# EAGLE design Mixer (EAGLE 9.3.1)
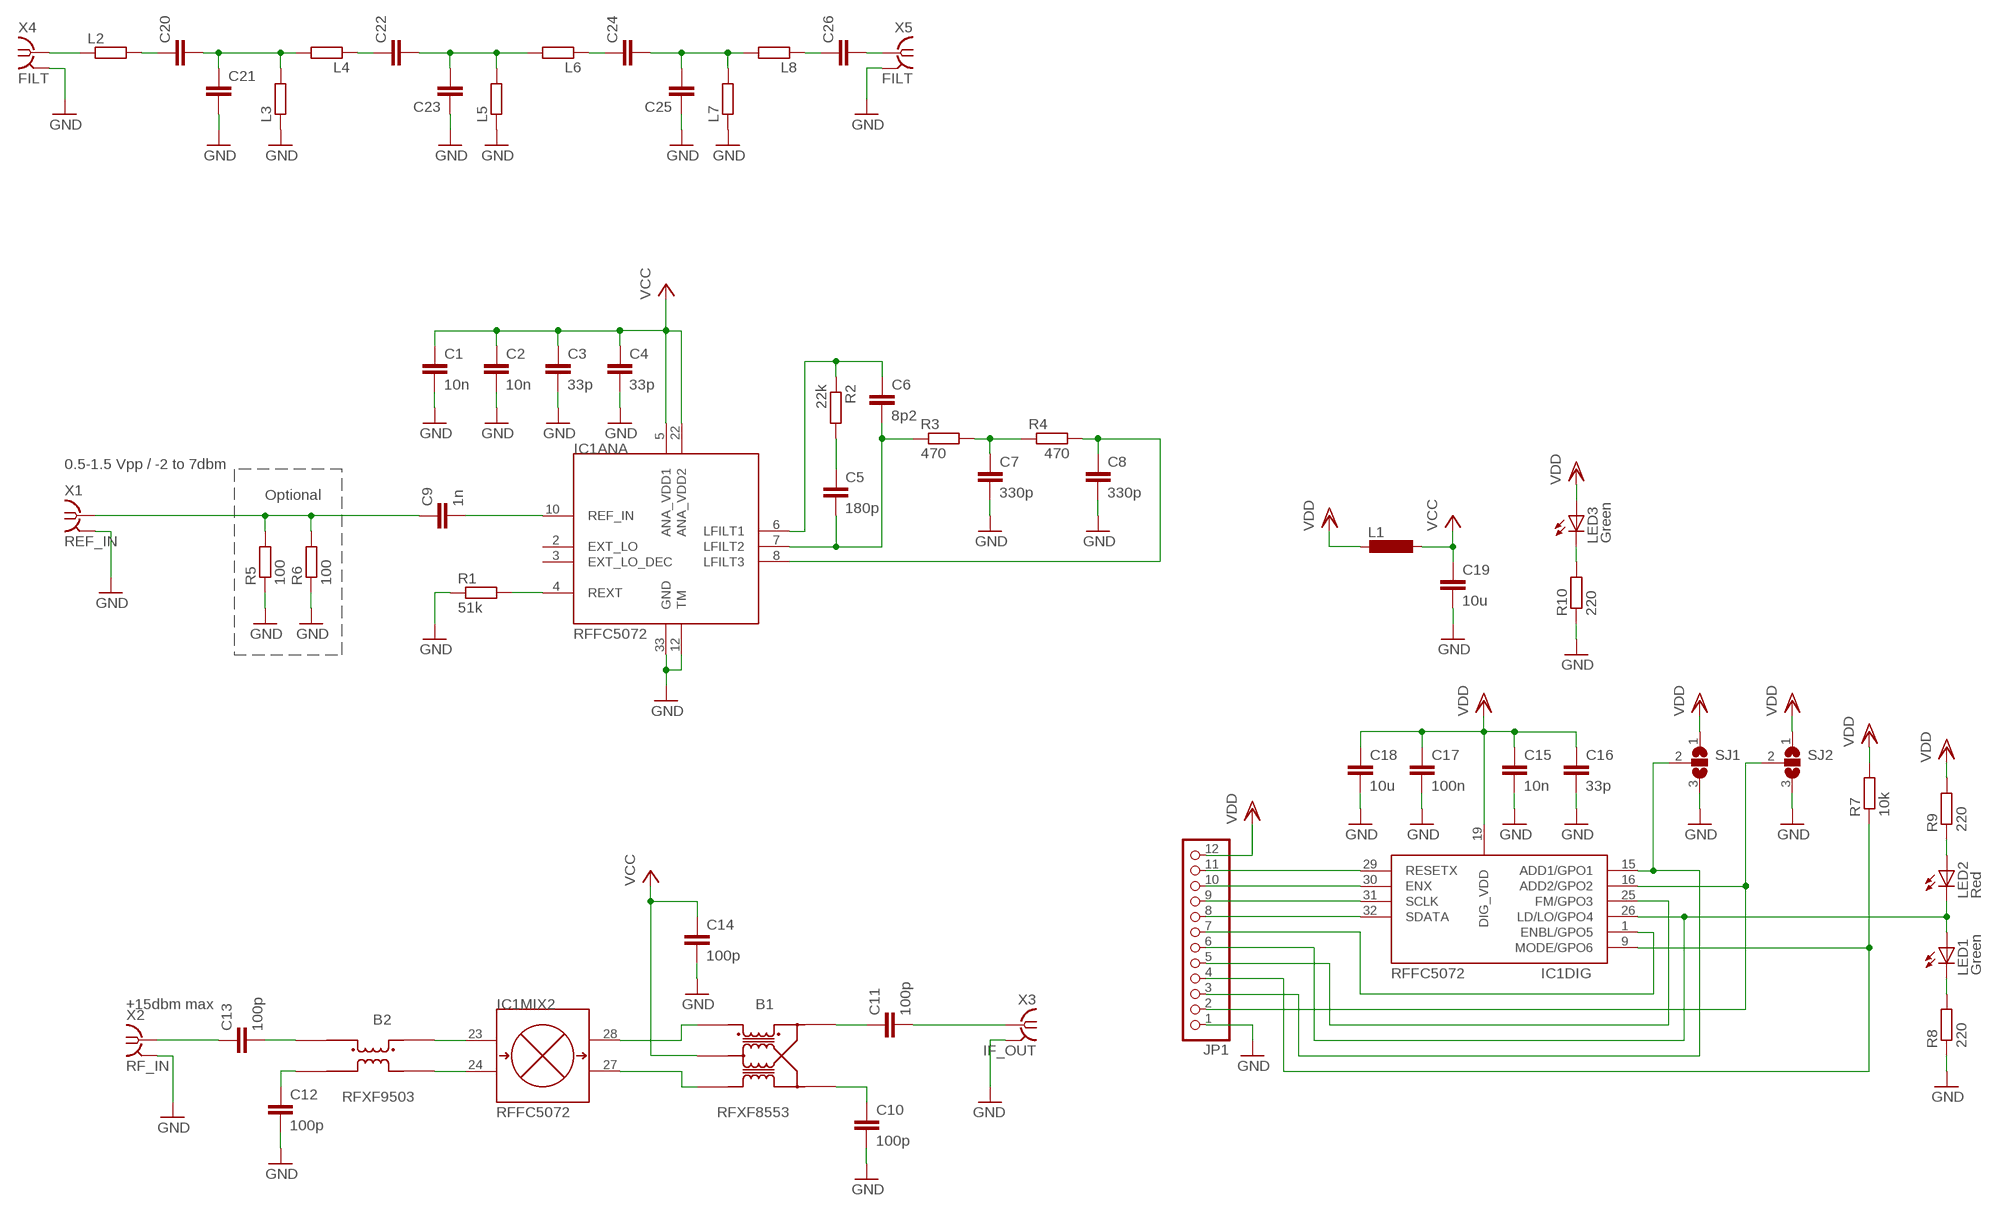
[diagram p0: schematic, sheet 1]

## Parts
B1  RFXF8553  [S20]
B2  RFXF9503  [S20]
C1  10n  C-EUC0603  [C0603]
C2  10n  C-EUC0603  [C0603]
C3  33p  C-EUC0603  [C0603]
C4  33p  C-EUC0603  [C0603]
C5  180p  C-EUC0603  [C0603]
C6  8p2  C-EUC0603  [C0603]
C7  330p  C-EUC0603  [C0603]
C8  330p  C-EUC0603  [C0603]
C9  1n  C-EUC0603  [C0603]
C10  100p  C-EUC0603  [C0603]
C11  100p  C-EUC0603  [C0603]
C12  100p  C-EUC0603  [C0603]
C13  100p  C-EUC0603  [C0603]
C14  100p  C-EUC0603  [C0603]
C15  10n  C-EUC0603  [C0603]
C16  33p  C-EUC0603  [C0603]
C17  100n  C-EUC0603  [C0603]
C18  10u  C-EUC1206  [C1206]
C19  10u  C-EUC1206  [C1206]
C20  C-EUC0603  [C0603]
C21  C-EUC0603  [C0603]
C22  C-EUC0603  [C0603]
C23  C-EUC0603  [C0603]
C24  C-EUC0603  [C0603]
C25  C-EUC0603  [C0603]
C26  C-EUC0603  [C0603]
IC1  RFFC5072  [QFN50P500X500X95-33T370]
JP1  PINHD-1X12/90  [1X12/90]
L1  L-EUL2012C  [L2012C]
L2  R-EU_R0603  [R0603]
L3  R-EU_R0603  [R0603]
L4  R-EU_R0603  [R0603]
L5  R-EU_R0603  [R0603]
L6  R-EU_R0603  [R0603]
L7  R-EU_R0603  [R0603]
L8  R-EU_R0603  [R0603]
LED1  Green  LED_ESML0603  [LED_SML0603]
LED2  Red  LED_ESML0603  [LED_SML0603]
LED3  Green  LED_ESML0603  [LED_SML0603]
R1  51k  R-EU_R0603  [R0603]
R2  22k  R-EU_R0603  [R0603]
R3  470  R-EU_R0603  [R0603]
R4  470  R-EU_R0603  [R0603]
R5  100  R-EU_R0603  [R0603]
R6  100  R-EU_R0603  [R0603]
R7  10k  R-EU_R0603  [R0603]
R8  220  R-EU_R0603  [R0603]
R9  220  R-EU_R0603  [R0603]
R10  220  R-EU_R0603  [R0603]
SJ1  SJ2W  [SJ_2]
SJ2  SJ2W  [SJ_2]
X1  REF_IN  SMA-142-0701-881/886  [J502-ND-142-0701-881/886]
X2  RF_IN  SMA-142-0701-881/886  [J502-ND-142-0701-881/886]
X3  IF_OUT  SMA-142-0701-881/886  [J502-ND-142-0701-881/886]
X4  FILT  SMA-142-0701-881/886  [J502-ND-142-0701-881/886]
X5  FILT  SMA-142-0701-881/886  [J502-ND-142-0701-881/886]

## Nets
GND: C1.2 C2.2 C3.2 C4.2 C7.2 C8.2 C10.2 C12.2 C14.2 C15.2 C16.2 C17.2 C18.2 C19.2 C21.2 C23.1 C25.1 IC1.12(ANA:TM) IC1.33(ANA:GND) JP1.1 L3.1 L5.1 L7.1 R1.1 R5.1 R6.1 R8.1 R10.1 SJ1.3 SJ2.3 X1.G@1 X1.G@2 X1.G@3 X1.G@4 X2.G@1 X2.G@2 X2.G@3 X2.G@4 X3.G@1 X3.G@2 X3.G@3 X3.G@4 X4.G@1 X4.G@2 X4.G@3 X4.G@4 X5.G@1 X5.G@2 X5.G@3 X5.G@4
N$1: IC1.4(ANA:REXT) R1.2
N$2: IC1.9(DIG:MODE/GPO6) JP1.4 R7.1
N$3: C6.1 IC1.6(ANA:LFILT1) R2.1
N$4: C5.2 C6.2 IC1.7(ANA:LFILT2) R3.1
N$5: C5.1 R2.2
N$6: C7.1 R3.2 R4.1
N$7: C8.1 IC1.8(ANA:LFILT3) R4.2
N$8: C9.2 IC1.10(ANA:REF_IN)
N$9: C9.1 R5.2 R6.2 X1.1
N$10: B2.P$3 IC1.23(MIX2:IPP)
N$11: B2.P$1 IC1.24(MIX2:IPN)
N$12: B1.P$1 IC1.28(MIX2:OPP)
N$13: B1.P$3 IC1.27(MIX2:OPN)
N$14: LED1.C R8.2
N$15: B2.P$5 C12.1
N$16: B2.P$4 C13.2
N$17: B1.P$5 C10.1
N$18: B1.P$4 C11.1
N$19: C13.1 X2.1
N$20: C11.2 X3.1
N$21: IC1.15(DIG:ADD1/GPO1) JP1.3 SJ1.2
N$22: LED2.A R9.1
N$23: IC1.26(DIG:LD/LO/GPO4) JP1.6 LED1.A LED2.C
N$24: IC1.16(DIG:ADD2/GPO2) JP1.2 SJ2.2
N$25: IC1.29(DIG:RESETX) JP1.11
N$26: IC1.30(DIG:ENX) JP1.10
N$27: IC1.31(DIG:SCLK) JP1.9
N$28: IC1.32(DIG:SDATA) JP1.8
N$29: LED3.C R10.2
N$30: IC1.1(DIG:ENBL/GPO5) JP1.7
N$31: L2.1 X4.1
N$32: IC1.25(DIG:FM/GPO3) JP1.5
N$33: C20.1 L2.2
N$34: C20.2 C21.1 L3.2 L4.2
N$35: C22.1 L4.1
N$36: C22.2 C23.2 L5.2 L6.2
N$37: C24.1 L6.1
N$38: C24.2 C25.2 L7.2 L8.2
N$39: C26.1 L8.1
N$40: C26.2 X5.1
VCC: B1.P$2 C1.1 C2.1 C3.1 C4.1 C14.1 C19.1 IC1.5(ANA:ANA_VDD1) IC1.22(ANA:ANA_VDD2) L1.1
VDD: C15.1 C16.1 C17.1 C18.1 IC1.19(DIG:DIG_VDD) JP1.12 L1.2 LED3.A R7.2 R9.2 SJ1.1 SJ2.1
Unconnected: IC1.2(ANA:EXT_LO) IC1.3(ANA:EXT_LO_DEC)

## Notes on the sheet
- 0.5-1.5 Vpp / -2 to 7dbm
- Optional
- +15dbm max

## Library data of the parts
B1 = rf:RFXF8553
B2 = rf:RFXF9503
C1-C26 = rcl:C-EU: CAPACITOR, European symbol
IC1 = rf:RFFC5072
JP1 = pinhead:PINHD-1X12: PIN HEADER
L1 = rcl:L-EU: INDUCTOR, European symbol
L2-L8 R1-R10 = resistor:R-EU_: RESISTOR, European symbol
LED1-LED3 = eagle-ltspice:LED_E: LED Source: http://www.osram.convergy.de Source: www.luxeon.com Source: www.kingbright.com; SPICEMODEL: NONE; SPICEPREFIX: D; SPICETYPE: diode
SJ1 SJ2 = jumper:SJ2W: SMD solder JUMPER
X1-X5 = con-coax:SMA-: SMA 50 Ohm End Launch Jack Receptacle - Round Contact Johnson Components Source: www.johnsoncomponents.com .. J502-ND.pdf; MF: JOHNSON COMPONENTS; MPN: 142-0701-881; OC_FARNELL: 1608603; OC_NEWARK: 08B906

## Board
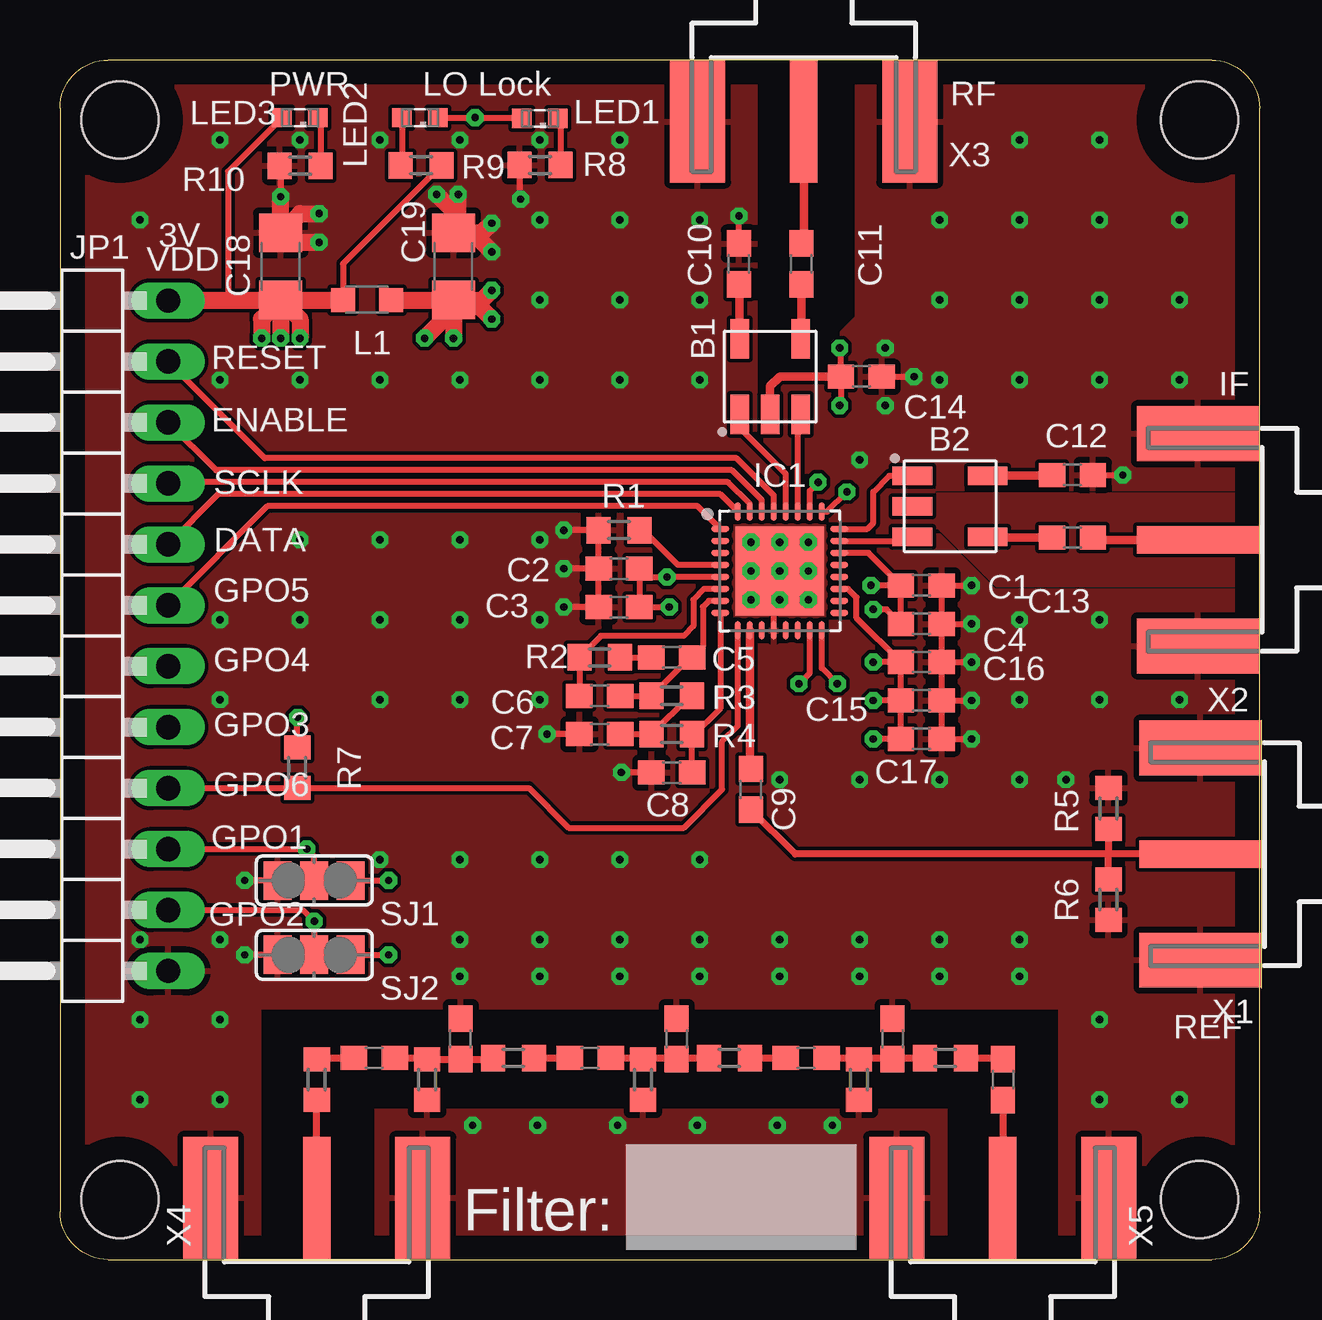
[diagram p1: board, top side]
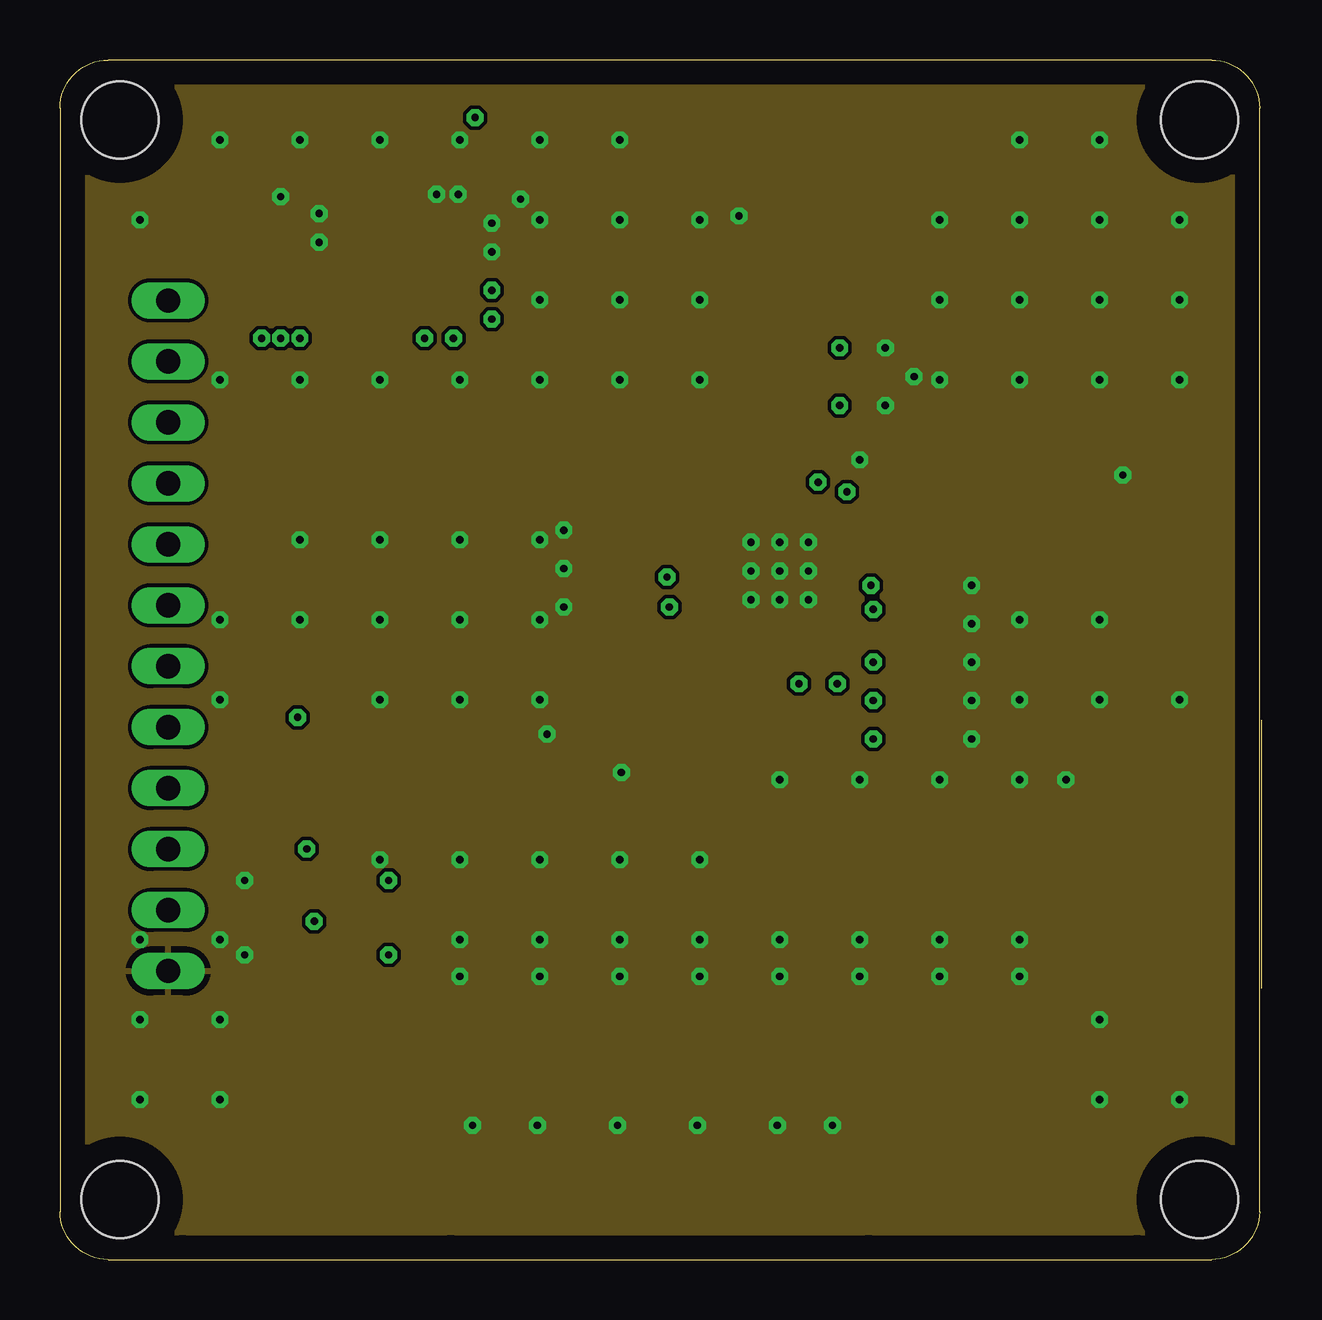
[diagram p2: board, inner layer Route2]
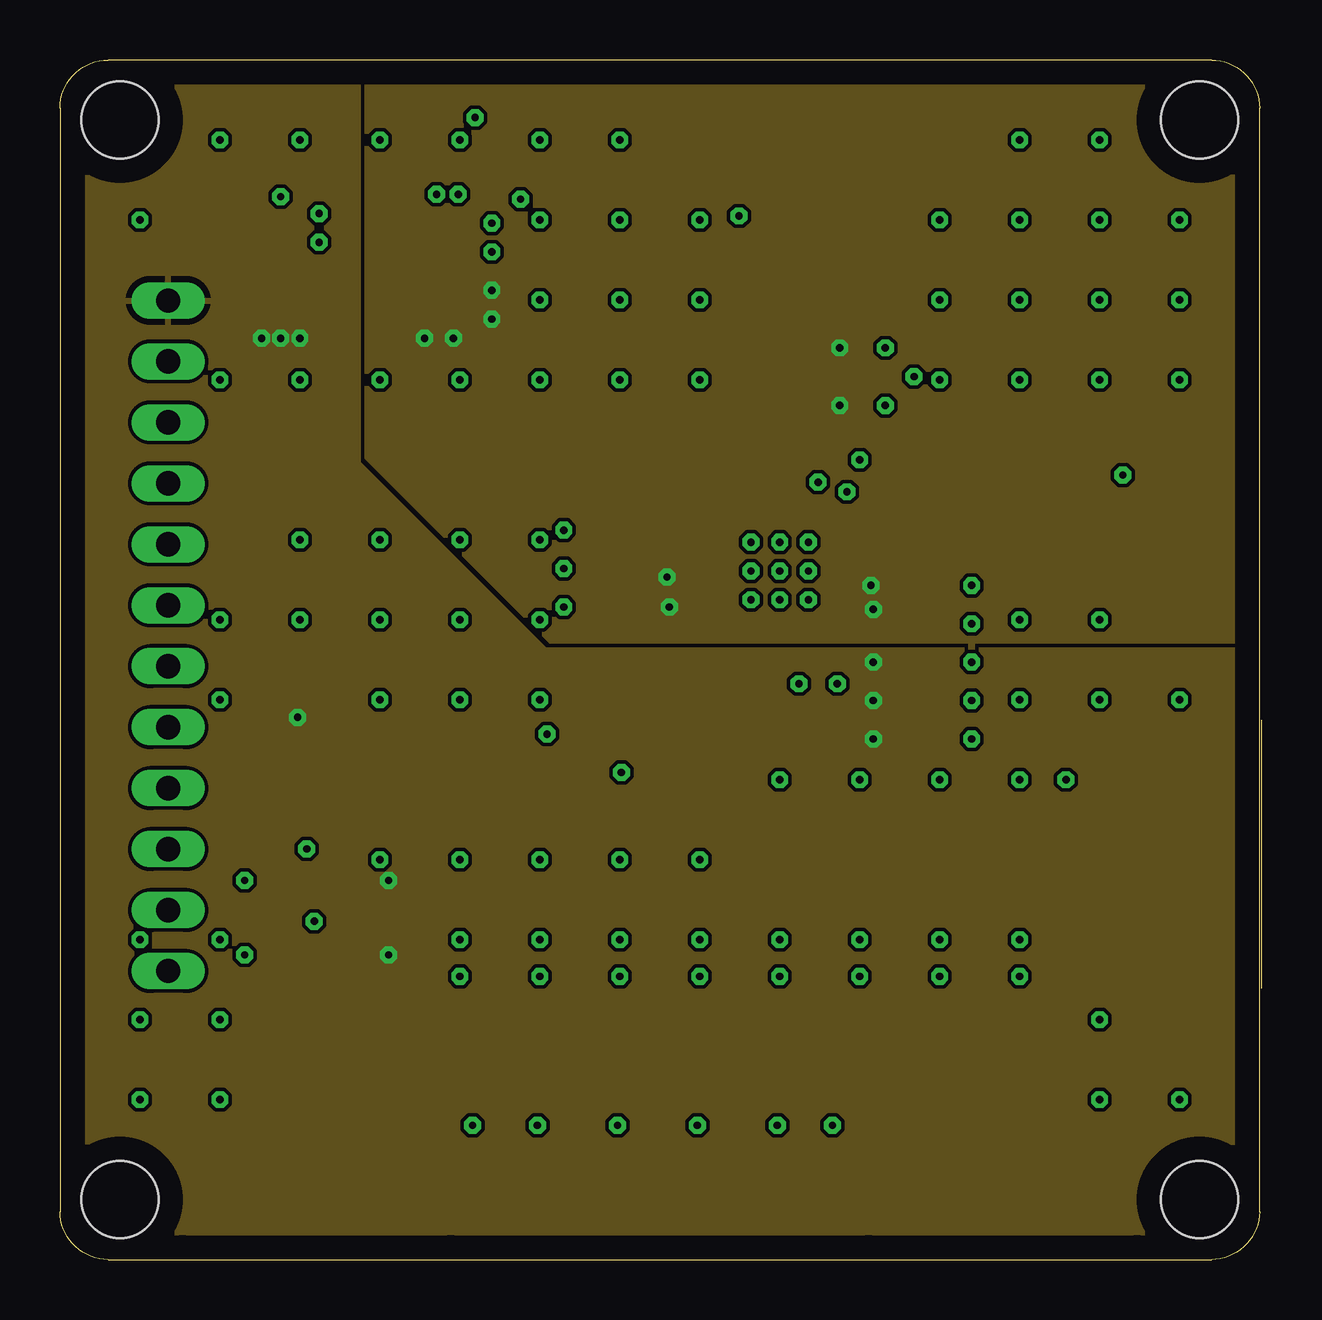
[diagram p3: board, inner layer Route15]
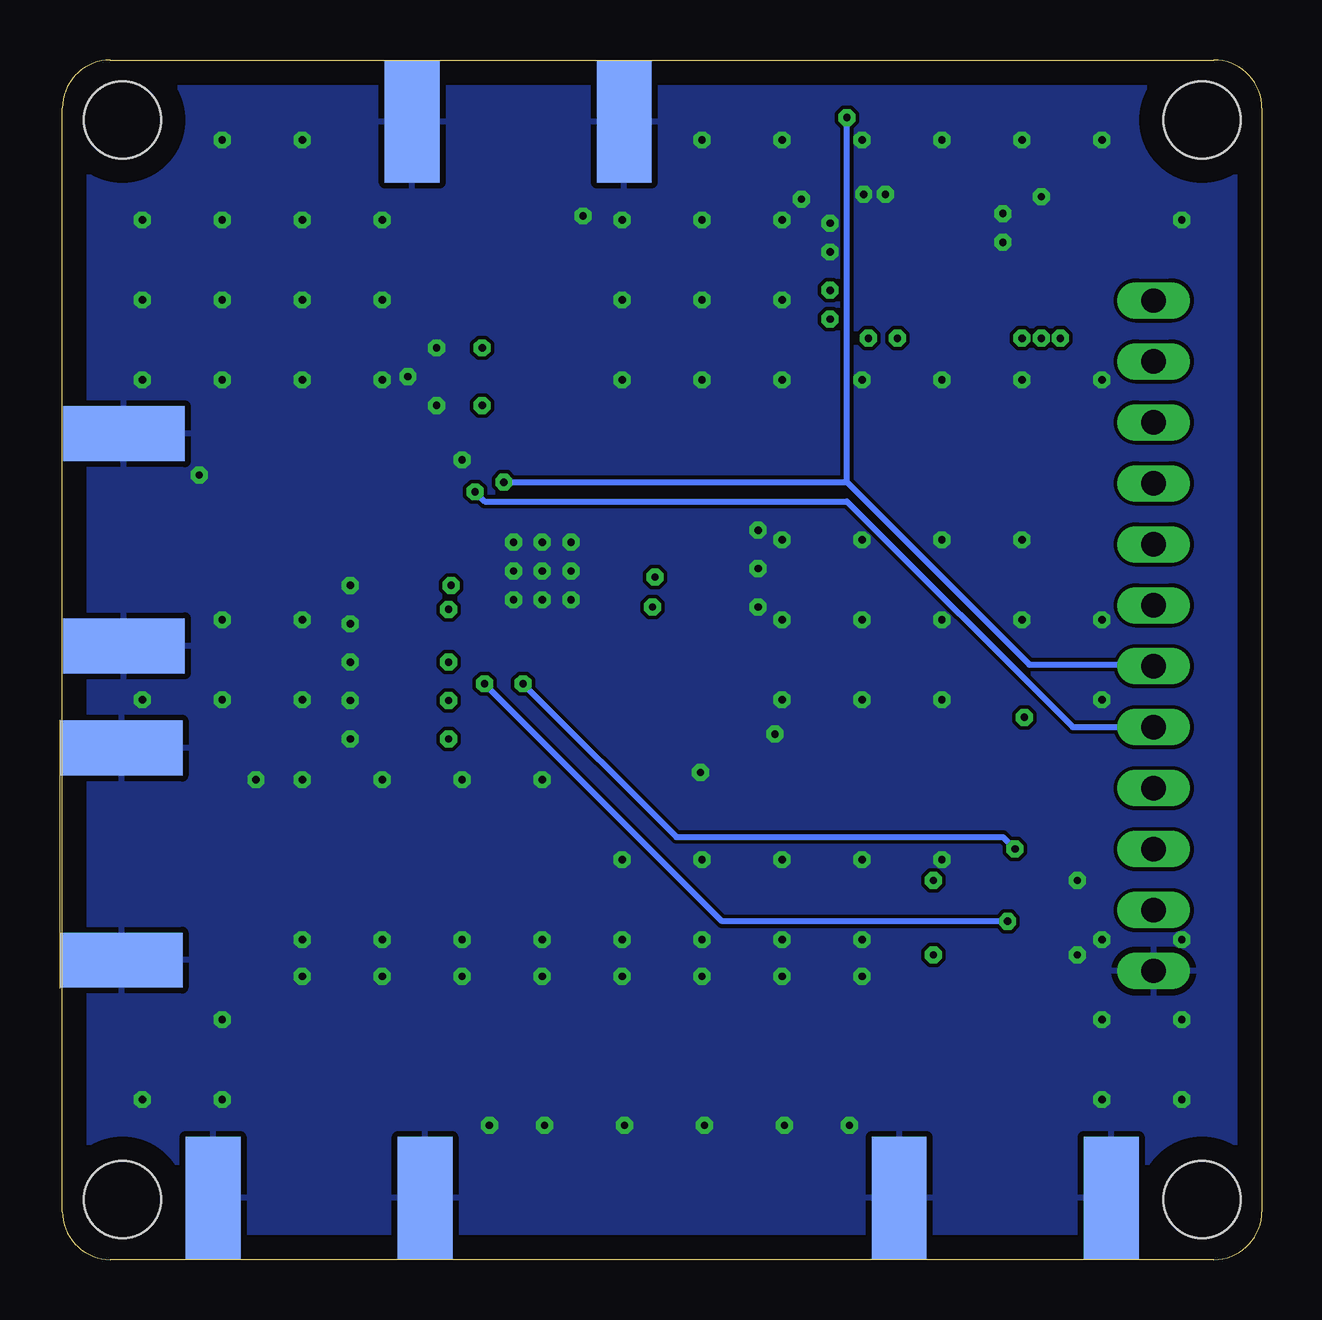
[diagram p4: board, bottom side, seen from below]

Size 50 x 50 mm. Coordinates in mm from the lower left corner, seen from the top.
Outline: 0,48 0,2 arc90 2,0 48,0 arc90 50,2 50,48 arc90 48,50 2,50 arc90 0,48
Copper layers (1+2*15+16): Top 0.035mm / dielectric 0.18mm / Route2 0.017mm / dielectric 1.12mm / Route15 0.017mm / dielectric 0.18mm / Bottom 0.035mm
Design rules "default *": minimum track width 6mil, minimum drill 0.3mm, track to track 6mil, track to pad 6mil, pad to pad 6mil, via to via 6mil, smd to smd 6mil, copper to edge 40mil, drill to drill 6mil, minimum pad ring 10mil, minimum via ring 8mil, stop-mask expansion 4mil, vias tented up to drill 0mil, thermal gap 10mil
Holes 3.2 mm at 2.5,47.5 47.5,47.5 47.5,2.5 2.5,2.5
tRestrict: area 8.8,6.3 to 41.6,10.4; area 37,0.8 to 41.6,10.4; area 8.4,1 to 13.1,10.4; 6 lines

### Footprints (pad centres in the part's own frame; a part is rotated, then mirrored left to right if it is on the bottom)
S20 = smd 0.76 x 1.65: P$1 -1.27,-1.57; P$2 0,-1.57; P$3 1.27,-1.57; P$4 1.27,1.57; P$5 -1.27,1.57
C0603 = smd 1.1 x 1: 1 -0.85,0; 2 0.85,0
C1206 = smd 1.6 x 1.8: 1 -1.4,0; 2 1.4,0
QFN50P500X500X95-33T370 = smd 0.761 x 0.25: 1 -2.476,1.75; 2 -2.476,1.25; 3 -2.476,0.75; 4 -2.476,0.25; 5 -2.476,-0.25; 6 -2.476,-0.75; 7 -2.476,-1.25; 8 -2.476,-1.75; 17 2.476,-1.75; 18 2.476,-1.25; 19 2.476,-0.75; 20 2.476,-0.25; 21 2.476,0.25; 22 2.476,0.75; 23 2.476,1.25; 24 2.476,1.75 | smd 0.25 x 0.761: 9 -1.75,-2.476; 10 -1.25,-2.476; 11 -0.75,-2.476; 12 -0.25,-2.476; 13 0.25,-2.476; 14 0.75,-2.476; 15 1.25,-2.476; 16 1.75,-2.476; 25 1.75,2.476; 26 1.25,2.476; 27 0.75,2.476; 28 0.25,2.476; 29 -0.25,2.476; 30 -0.75,2.476; 31 -1.25,2.476; 32 -1.75,2.476 | smd 3.7 x 3.7: 33 0,0
1X12/90 = drill 1.016 long: 1 -13.97,-3.81; 2 -11.43,-3.81; 3 -8.89,-3.81; 4 -6.35,-3.81; 5 -3.81,-3.81; 6 -1.27,-3.81; 7 1.27,-3.81; 8 3.81,-3.81; 9 6.35,-3.81; 10 8.89,-3.81; 11 11.43,-3.81; 12 13.97,-3.81
L2012C = smd 1 x 1: 1 -1,0; 2 1,0
R0603 = smd 1 x 1.1: 1 -0.85,0; 2 0.85,0
LED_SML0603 = smd 0.8 x 0.8: A 0.75,0; C -0.75,0
SJ_2 = smd 1.168 x 1.6: 1 -1.524,0; 2 0,0; 3 1.524,0
J502-ND-142-0701-881/886 = smd 5.08 x 1.143: 1 2.565,0 | smd 5.08 x 2.286: G@1 2.565,4.42; G@2 2.565,-4.42 | smd 5.08 x 2.286 bottom: G@3 2.565,4.42; G@4 2.565,-4.42

### Placement (x,y rotation side)
B1  29.6,36.8 0 top
B2  37.1,31.4 270 top
C1  35.9,28.1 0 top
C2  23.3,28.8 180 top
C3  23.3,27.2 180 top
C4  35.9,26.5 0 top
C5  25.5,25.1 0 top
C6  22.5,23.5 0 top
C7  22.5,21.9 180 top
C8  25.5,20.3 180 top
C9  28.8,19.6 90 top
C10  28.3,41.5 90 top
C11  30.9,41.5 90 top
C12  42.2,32.7 0 top
C13  42.2,30.1 180 top
C14  33.4,36.8 0 top
C15  35.9,23.3 0 top
C16  35.9,24.9 0 top
C17  35.9,21.7 0 top
C18  9.2,41.4 90 top
C19  16.4,41.4 90 top
C20  13.1,8.4 0 top
C21  16.7,9.2 90 top
C22  22.1,8.4 0 top
C23  25.7,9.2 270 top
C24  31.1,8.4 0 top
C25  34.7,9.2 270 top
C26  39.3,7.5 270 top
IC1  30,28.7 0 top
JP1  0.7,26 90 top
L1  12.8,40 180 top
L2  10.7,7.5 90 top
L3  15.3,7.5 90 top
L4  18.9,8.4 180 top
L5  24.3,7.5 90 top
L6  27.9,8.4 180 top
L7  33.3,7.5 90 top
L8  36.9,8.4 180 top
LED1  20,47.56 180 top
LED2  15,47.6 180 top
LED3  10,47.6 180 top
R1  23.3,30.4 0 top
R2  22.5,25.1 0 top
R3  25.5,23.5 0 top
R4  25.5,21.9 0 top
R5  43.7,18.8 270 top
R6  43.7,15 90 top
R7  9.89,20.5 90 top
R8  20.01,45.62 0 top
R9  15.05,45.61 0 top
R10  10.01,45.59 0 top
SJ1  10.6,15.8 180 top
SJ2  10.6,12.7 180 top
X1  50.1,16.9 180 top
X2  50,30 180 top
X3  31,50 270 top
X4  10.7,0 90 top
X5  39.3,0 90 top

### Tracks (layer width: path | path; a pad name or v marks a point on that pad's centre or on a via)
GND  (via drill 0.3)
  Top 0.25: SJ2.3 v7.7,12.7 | SJ1.3 v7.7,15.8 | C8.2 v23.4,20.3 | C7.2 v20.3,21.9 | C14.2 v35.6,36.8 | R8.1 19.16,44.24 v19.2,44.2 | R10.1 9.2,45.55 v9.2,44.3 | C16.2 v38,24.9 | C15.2 v38,23.3 | v38,21.7 C17.2 C15.2 | C4.2 v38,26.5 | v38,28.1 C1.2 C4.2 | C15.2 C16.2 | C16.2 C4.2 | IC1.12 29.75,27.25 v30,27.5 | v21,30.4 R1.1 C2.2 | C2.2 v21,28.8 | v21,27.2 C3.2 C2.2 | C10.2 v28.3,43.5 | C12.2 v44.3,32.7
  Top 0.7: C19.2 17.2,42.8 v18,42 | C19.2 17.6,42.8 v18,43.2 | C19.2 16.6,43 v16.6,44.4 | C19.2 16.4,43.7 v15.7,44.4 | C18.2 v9.2,44.3 | C18.2 9.6,42.4 v10.8,42.4 | C18.2 10,43.6 v10.8,43.6
  other vias: 34.4,35.6 34.4,38 30,28.7 31.2,28.7 30,29.9 31.2,29.9 31.2,27.5 28.8,27.5 28.8,28.7 28.8,29.9 46.67,23.33 46.67,6.67 43.33,6.67 43.33,10 41.93,20 43.33,23.33 43.33,26.67 40,11.8 6.67,6.67 3.33,6.67 26.67,16.67 23.33,16.67 20,16.67 16.67,16.67 13.33,16.67 40,13.33 36.67,13.33 33.33,13.33 30,13.33 26.67,13.33 23.33,13.33 20,13.33 16.67,13.33 6.67,13.33 3.33,13.33 36.67,11.8 33.33,11.8 30,11.8 26.67,11.8 23.33,11.8 20,11.8 16.67,11.8 6.67,10 3.33,10 40,20 36.67,20 33.33,20 30,20 40,23.33 20,23.33 16.67,23.33 13.33,23.33 6.67,23.33 40,26.67 20,26.67 16.67,26.67 13.33,26.67 10,26.67 6.67,26.67 20,30 16.67,30 13.33,30 10,30 33.33,33.33 46.67,36.67 43.33,36.67 40,36.67 36.67,36.67 26.67,36.67 23.33,36.67 20,36.67 16.67,36.67 13.33,36.67 10,36.67 6.67,36.67 46.67,40 43.33,40 40,40 36.67,40 26.67,40 23.33,40 20,40 46.67,43.33 43.33,43.33 40,43.33 36.67,43.33 26.67,43.33 23.33,43.33 20,43.33 3.33,43.33 43.33,46.67 40,46.67 23.33,46.67 20,46.67 16.67,46.67 13.33,46.67 10,46.67 6.67,46.67 29.9,5.6 26.57,5.6 23.23,5.6 19.9,5.6 17.2,5.6 32.2,5.6
  pour Route2: -1.9,51.3 51.5,51.3 51.5,-2.5 -1.9,-2.5
  pour Top: -1.1,52.1 52.3,52.1 52.3,-1.7 -1.1,-1.7
  pour Bottom: -1.7,52.5 51.7,52.5 51.7,-1.3 -1.7,-1.3
N$1
  Top 0.25: IC1.4 25.75,28.95 24.3,30.4 R1.2
N$2
  Top 0.25: JP1.4 R7.1 19.55,19.65 21.2,18 26,18 27.6,19.6 27.6,21.6 28.25,22.25 IC1.9
N$3
  Top 0.25: IC1.6 26.85,27.95 26.4,27.5 26.4,26.4 26,26 22.55,26 R2.1 C6.1
N$4
  Top 0.25: IC1.7 27.05,27.45 26.8,27.2 26.8,25.55 C5.2 26.25,25.1 R3.1 C6.2
N$5
  Top 0.25: R2.2 C5.1
N$6
  Top 0.25: C7.1 R4.1 26.25,23.5 R3.2
N$7
  Top 0.25: C8.1 26.35,21.8 | 26.35,21.8 R4.2 | IC1.8 27.52,22.97 26.35,21.8
N$8
  Top 0.35: IC1.10 28.75,20.5 C9.2
N$9
  Top 0.3: X1.1 43.7,16.9 | 43.7,16.9 43.6,16.9 | 43.6,16.9 30.65,16.9 C9.1 | R5.2 43.7,17 43.6,16.9 | R6.2 43.7,16.9
N$10
  Top 0.25: IC1.23 35.35,29.95 B2.P$3
N$11
  Top 0.25: IC1.24 33.65,30.45 33.9,30.7 33.9,32 34.57,32.67 B2.P$1
N$12
  Top 0.25: IC1.28 30.25,32.75 28.33,34.67 B1.P$1
N$13
  Top 0.25: IC1.27 30.75,35.11 B1.P$3
N$14
  Top 0.25: LED1.C 20.86,47.45 R8.2
N$15
  Top 0.35: B2.P$5 41.32,32.67 C12.1
N$16
  Top 0.35: C13.2 38.7,30.1 B2.P$4
N$17
  Top 0.35: B1.P$5 28.33,40.62 C10.1
N$18
  Top 0.35: C11.1 30.9,38.4 B1.P$4
N$19
  Top 0.35: X2.1 43.15,30 C13.1
N$20
  Top 0.35: X3.1 31,42.45 C11.2
N$21  (via drill 0.3)
  Top 0.25: JP1.3 v10.29,17.11 10.6,16.8 SJ1.2 | v30.8,24 31.25,24.45 IC1.15
  Bottom 0.25: v10.29,17.11 10.79,17.61 24.41,17.61 v30.8,24
N$22
  Top 0.25: LED2.A 14.25,45.66 R9.1
N$23  (via drill 0.3)
  Top 0.25: LED2.C v17.3,47.6 19.21,47.6 LED1.A | IC1.26 31.25,32.05 v31.6,32.4
  Bottom 0.25: v31.6,32.4 17.3,32.4 | 17.3,32.4 9.7,24.8 4.58,24.8 JP1.6 | 17.3,32.4 v17.3,47.6
N$24  (via drill 0.3)
  Top 0.25: JP1.2 10.13,14.57 v10.6,14.1 SJ2.2 | v32.4,24 31.75,24.65 IC1.16
  Bottom 0.25: v10.6,14.1 22.5,14.1 v32.4,24
N$25
  Top 0.25: IC1.29 29.75,31.85 28.2,33.4 8.54,33.4 JP1.11
N$26
  Top 0.25: IC1.30 29.25,31.65 28,32.9 6.5,32.9 JP1.10
N$27
  Top 0.25: JP1.9 4.56,32.4 27.85,32.4 28.75,31.5 IC1.31
N$28
  Top 0.25: IC1.32 27.53,31.9 6.6,31.9 JP1.8
N$29
  Top 0.25: LED3.C 10.86,47.49 R10.2
N$30
  Top 0.25: IC1.1 26.57,31.4 8.64,31.4 JP1.7
N$31
  Top 0.3: X4.1 L2.1
N$32  (via drill 0.3)
  Top 0.25: IC1.25 31.98,31.18 v32.8,32
  Bottom 0.25: v32.8,32 32.4,31.6 17.3,31.6 7.89,22.19 JP1.5
N$33
  Top 0.3: L2.2 10.75,8.4 C20.1
N$34
  Top 0.3: C20.2 15.25,8.4 L3.2 C21.1 18,8.35 L4.2
N$35
  Top 0.3: L4.1 C22.1
N$36
  Top 0.3: C22.2 24.4,8.4 | 24.4,8.4 25.7,8.4 | 25.7,8.4 L6.2 | C23.2 25.7,8.4 | L5.2 24.35,8.35 24.4,8.4
N$37
  Top 0.3: L6.1 C24.1
N$38
  Top 0.3: C24.2 33.4,8.4 | 33.4,8.4 34.8,8.4 | 34.8,8.4 L8.2 | L7.2 33.35,8.35 33.4,8.4 | C25.2 34.75,8.35 34.8,8.4
N$39
  Top 0.3: L8.1 39.25,8.4 C26.1
N$40
  Top 0.3: C26.2 X5.1
VCC  (via drill 0.3)
  Top 0.25: IC1.5 v25.3,28.45 24.5,28.45 C2.1 C3.1 v25.4,27.2 | C1.1 C4.1 34.45,27.1 v33.9,27.1 | C1.1 33.7,29.45 IC1.22 | C1.1 v33.8,28.1 | v32.5,35.6 32.55,35.65 C14.1 32.55,37.95 v32.5,38
  Top 0.35: C14.1 30,36.8 29.6,36.4 B1.P$2
  Top 0.7: L1.1 C19.1 | C19.1 v16.4,38.4 | C19.1 17.6,40 v18,40.4 | C19.1 17.2,40 v18,39.2 | C19.1 16.4,39.6 v15.2,38.4
  pour Route15 (rank 2): 10.6,54.1 10.6,32.9 20,23.5 52.1,23.5 52.1,52.2 50.2,54.1
VDD  (via drill 0.3)
  Top 0.25: SJ1.1 v13.7,15.8 | SJ2.1 v13.7,12.7 | LED3.A 7,45.35 7,40 | R9.2 11.8,41.51 L1.2 | C15.1 C17.1 v33.9,21.7 | C15.1 C16.1 | C16.1 33.2,26.75 33.2,27.6 32.85,27.95 IC1.19 | C16.1 v33.9,24.9 | C15.1 v33.9,23.3 | R7.2 v9.89,22.59 v9.9,22.6
  Top 0.7: JP1.12 4.54,40 7,40 C18.1 | C18.1 L1.2 | C18.1 v9.2,38.4 | C18.1 10,39.2 v10,38.4 | C18.1 8.4,39.2 v8.4,38.4
  pour Route15: -1.5,51.2 12.4,51.2 12.4,33.2 20.2,25.4 51.8,25.4 51.8,-1.9 -1.5,-1.9

### Text on the board
tPlace: PWR | LO Lock | RF | 3V | VDD | RESET | IF | ENABLE | SCLK | DATA | GPO5 | GPO4 | GPO3 | GPO6 | GPO1 | GPO2 | REF | Filter: